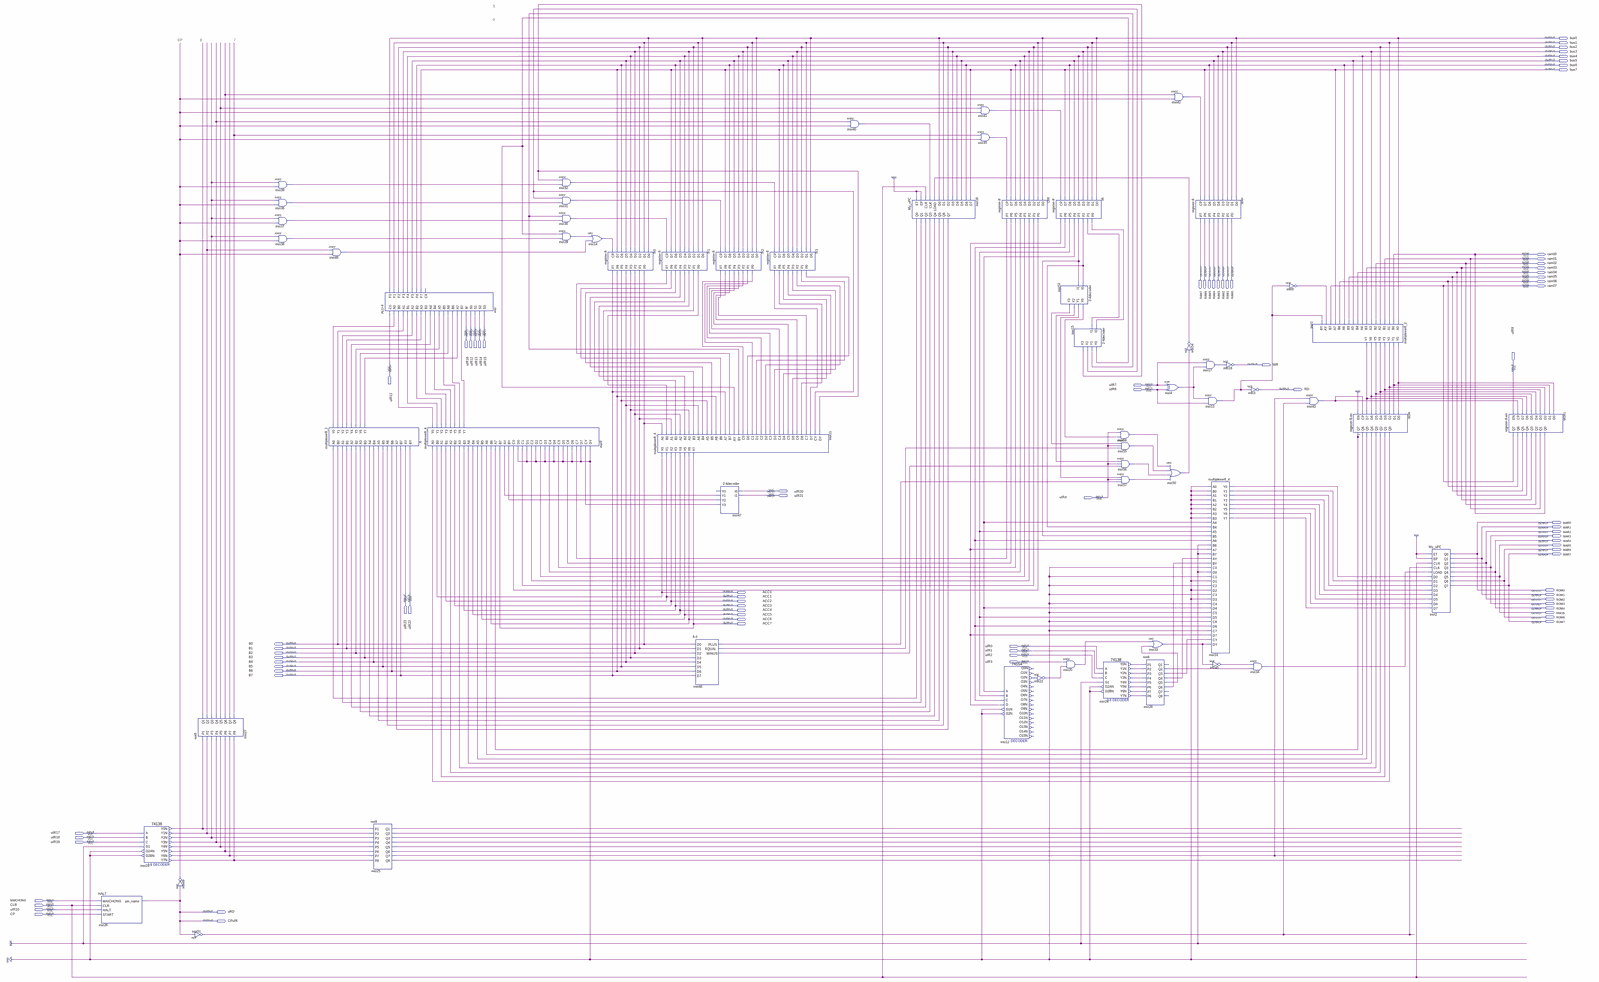
[diagram p0: schematic sheet, whole]
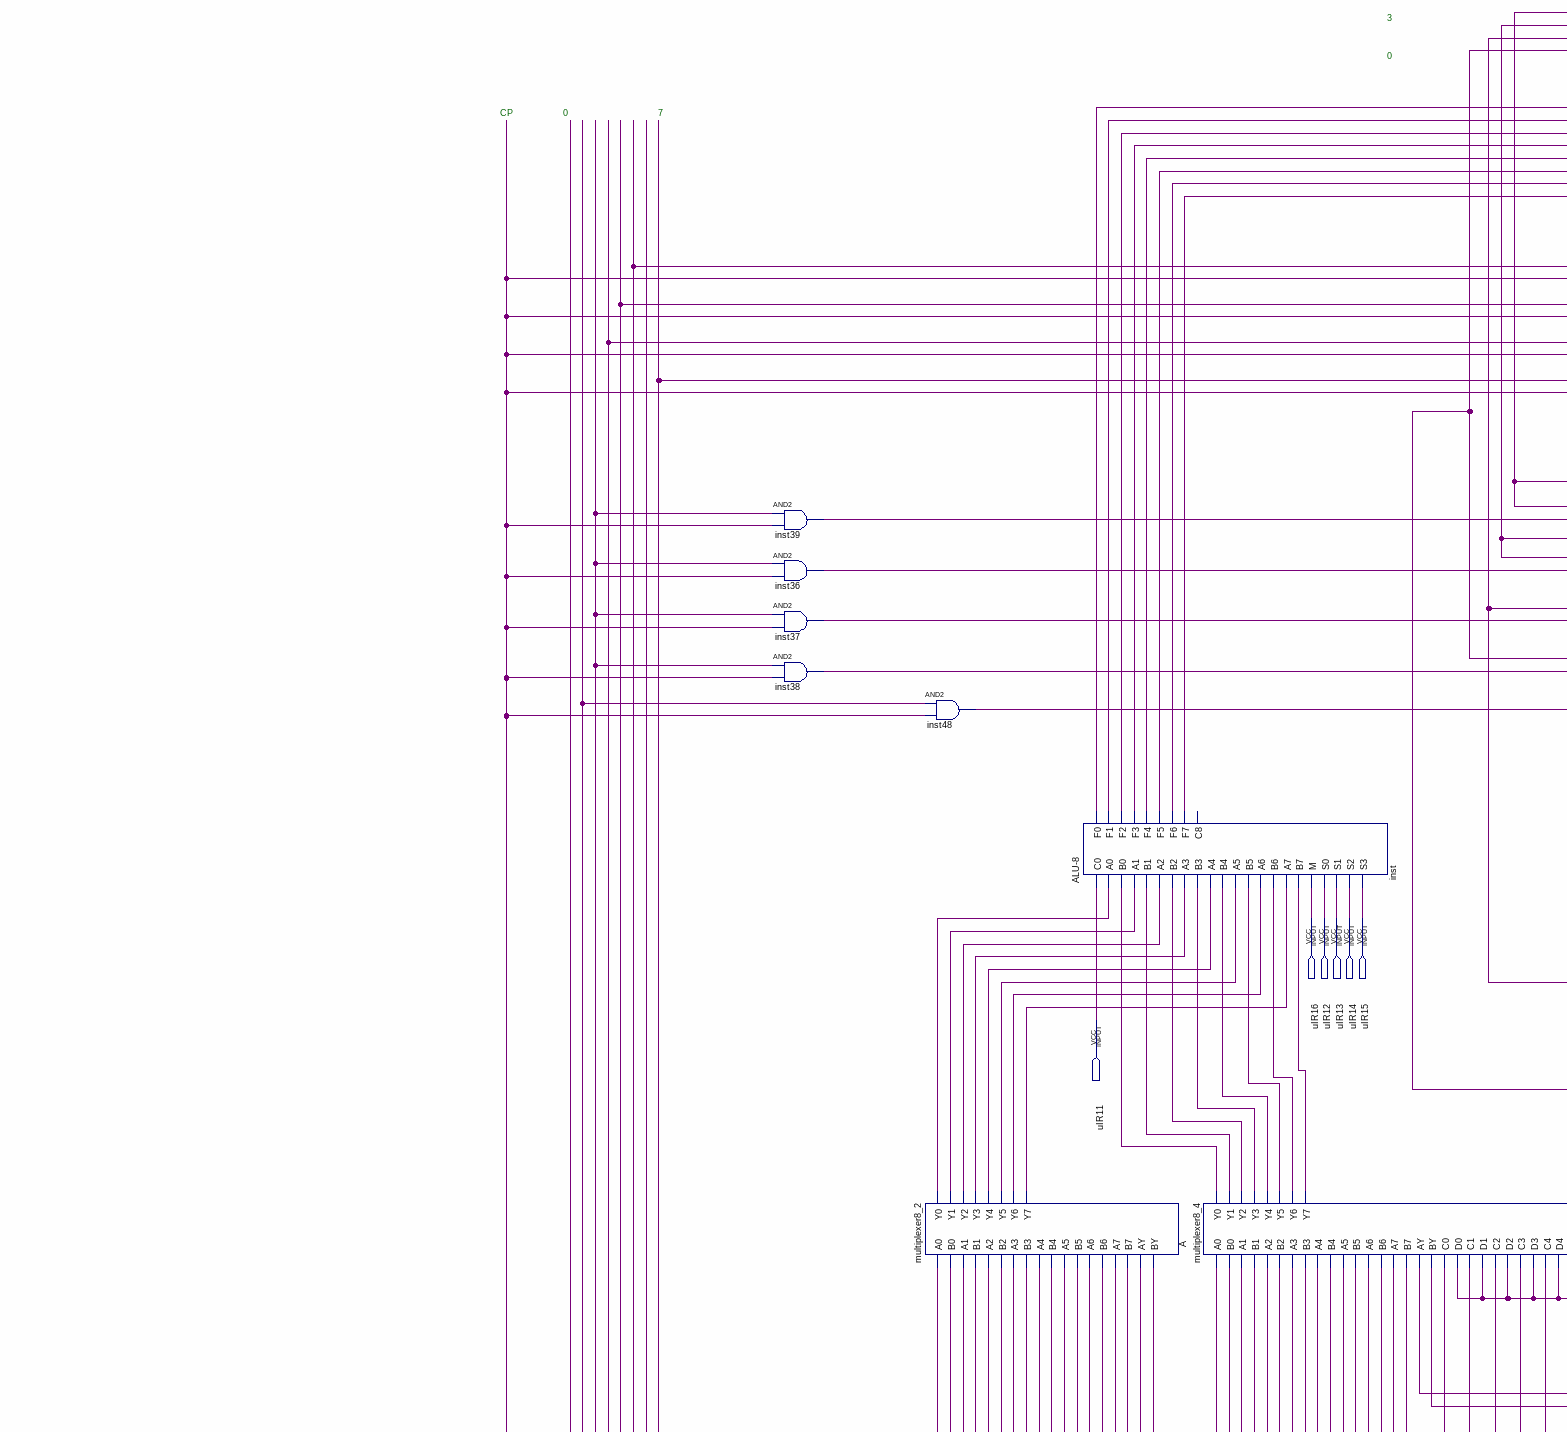
[diagram p1: schematic sheet, upper left part]
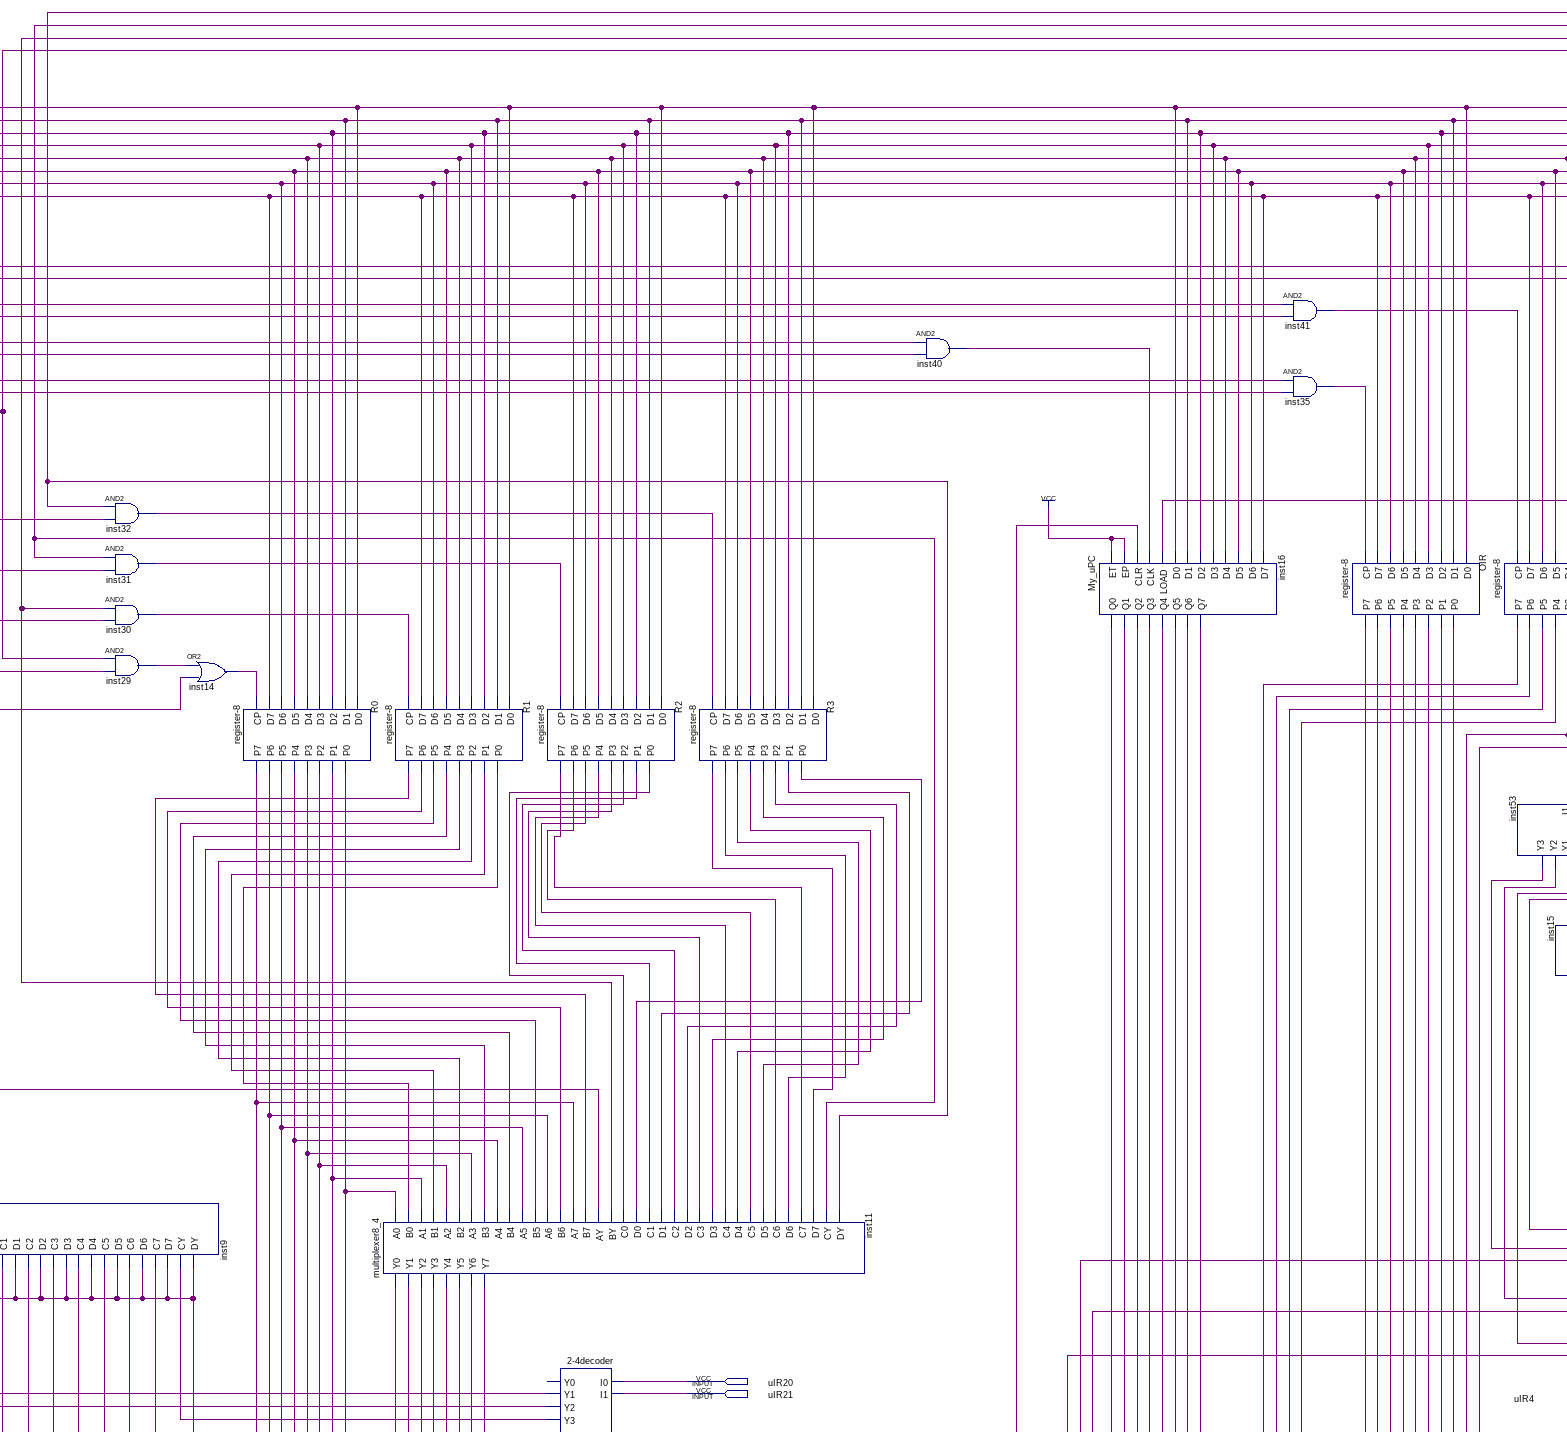
[diagram p2: schematic sheet, upper centre part]
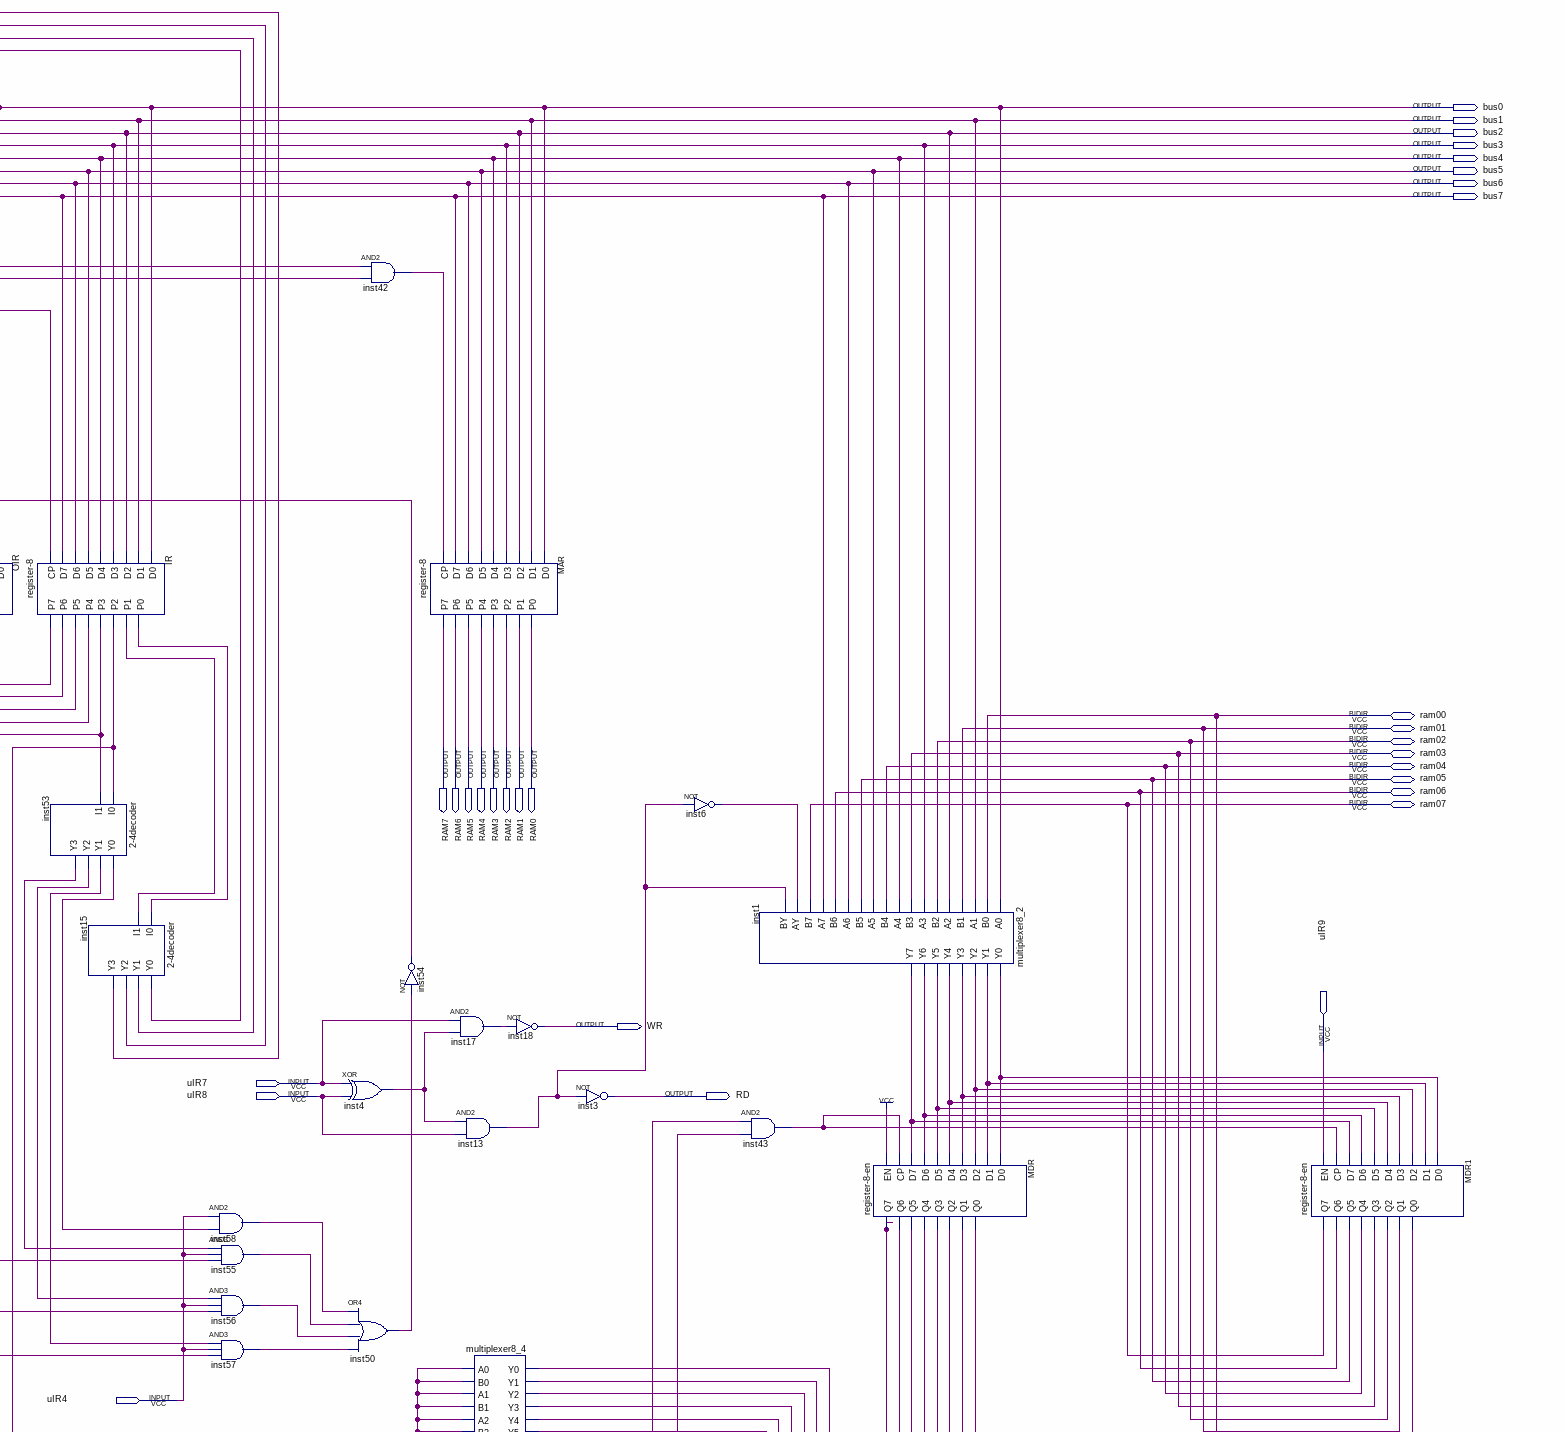
[diagram p3: schematic sheet, upper right part]
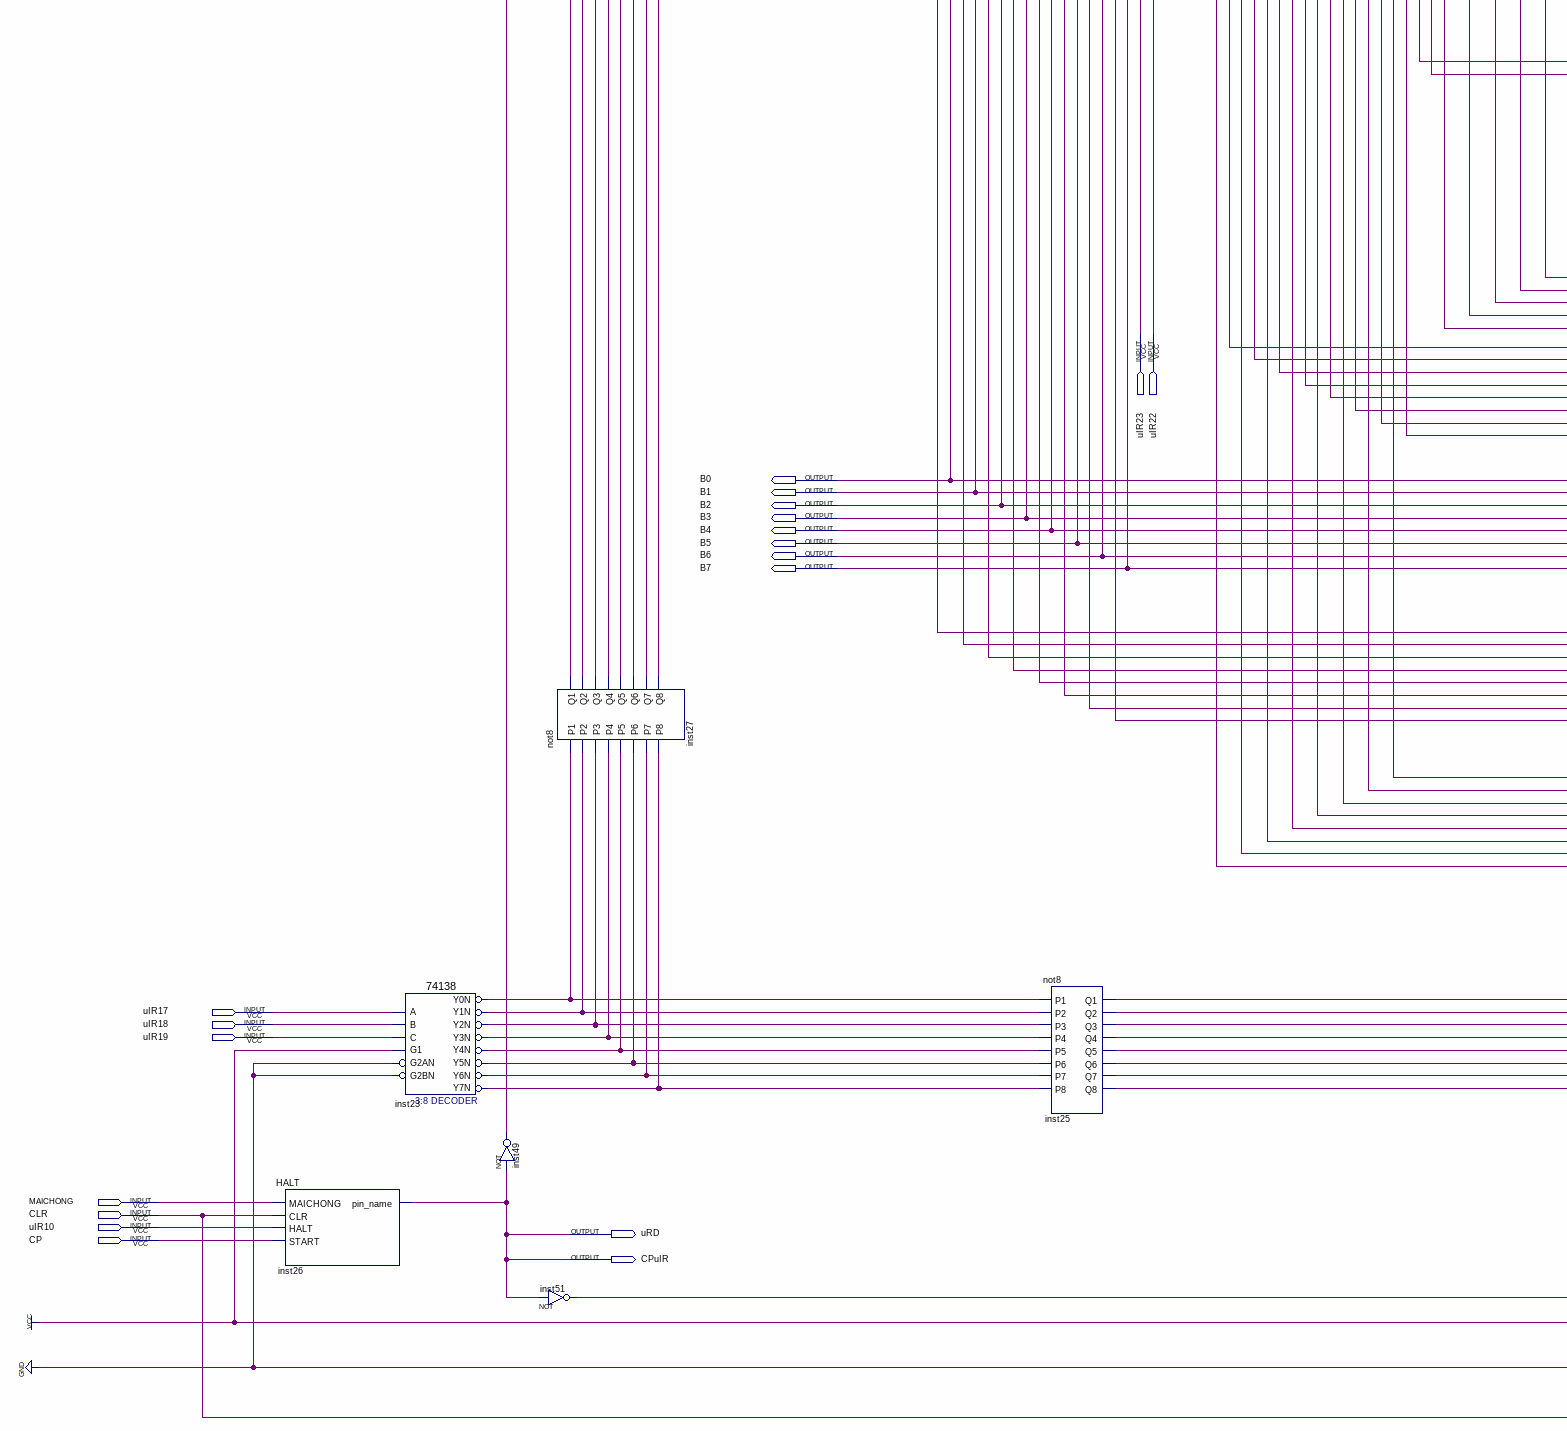
[diagram p4: schematic sheet, lower left part]
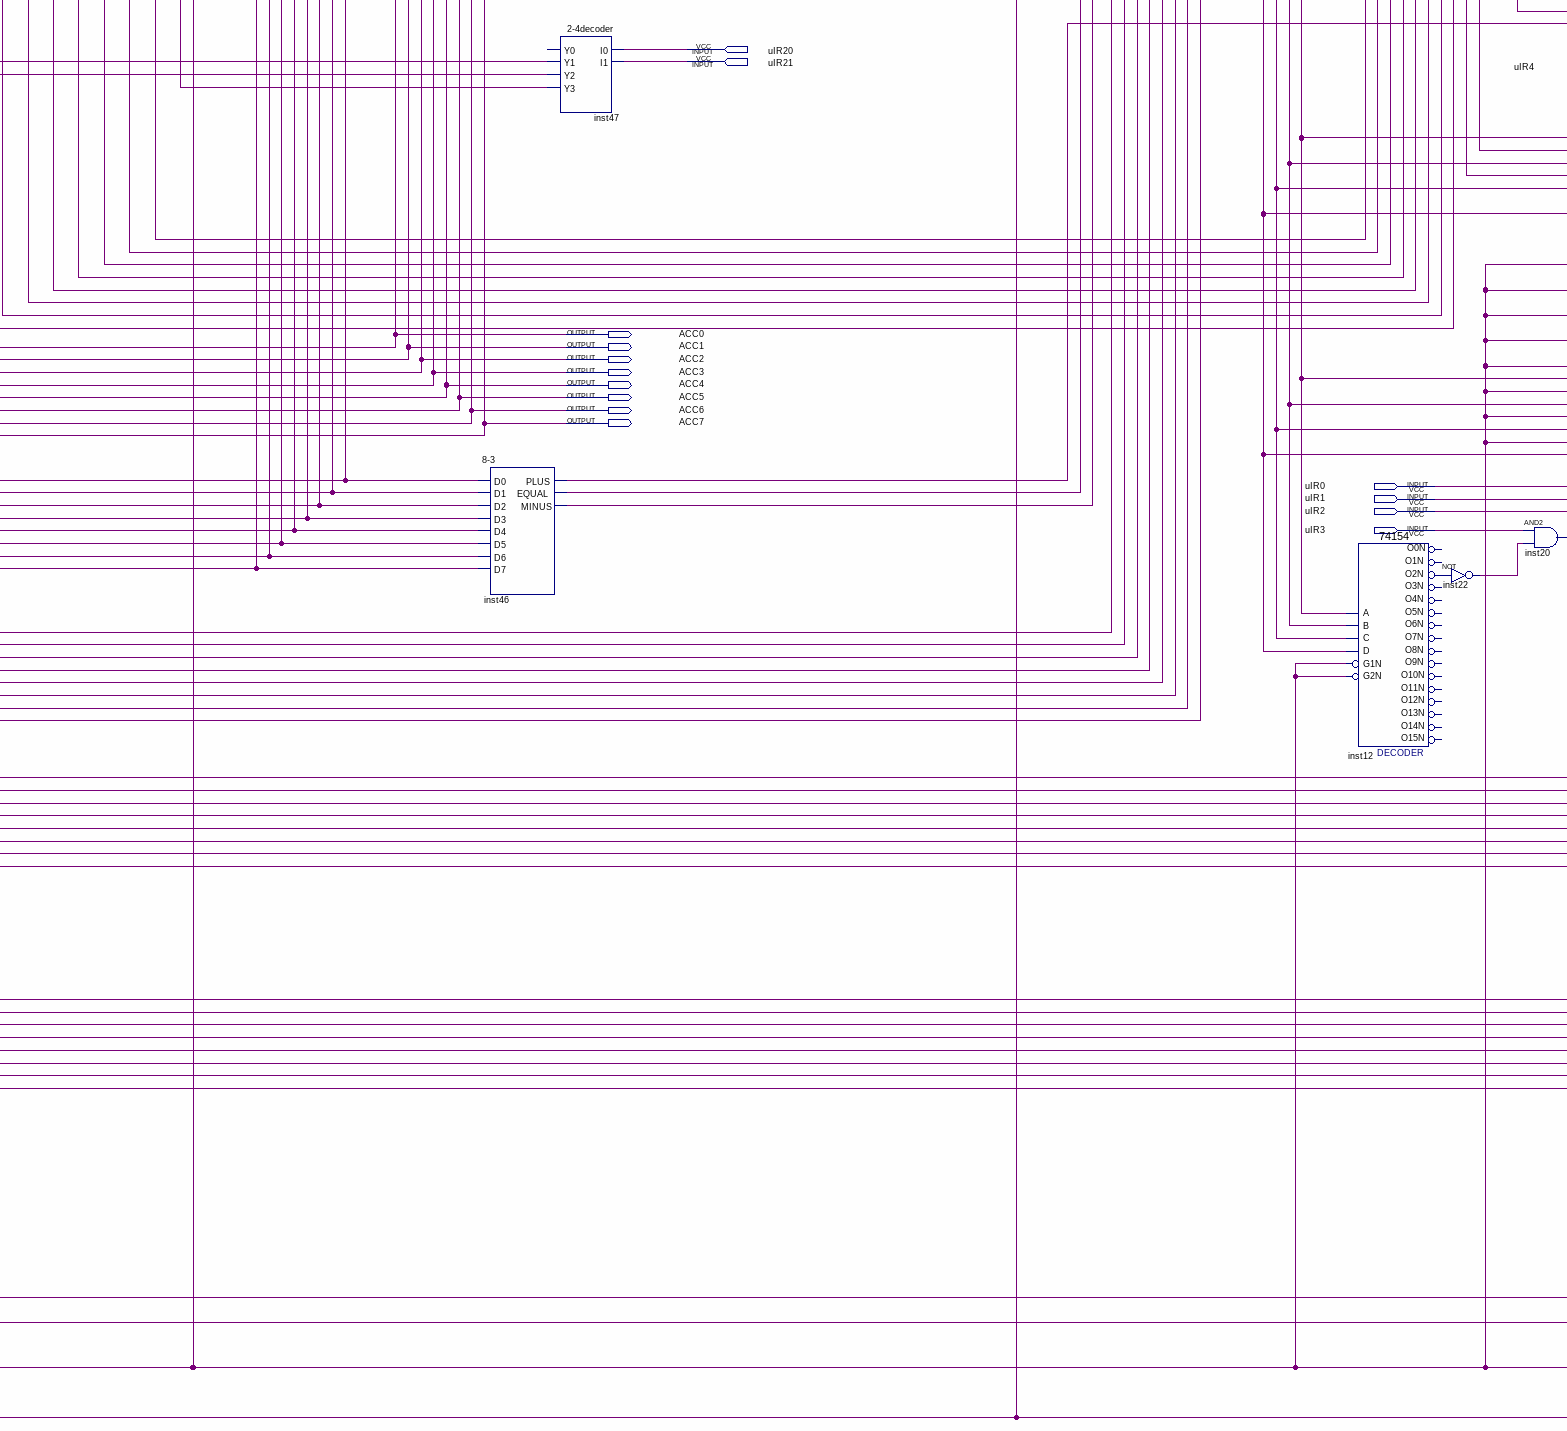
[diagram p5: schematic sheet, lower centre part]
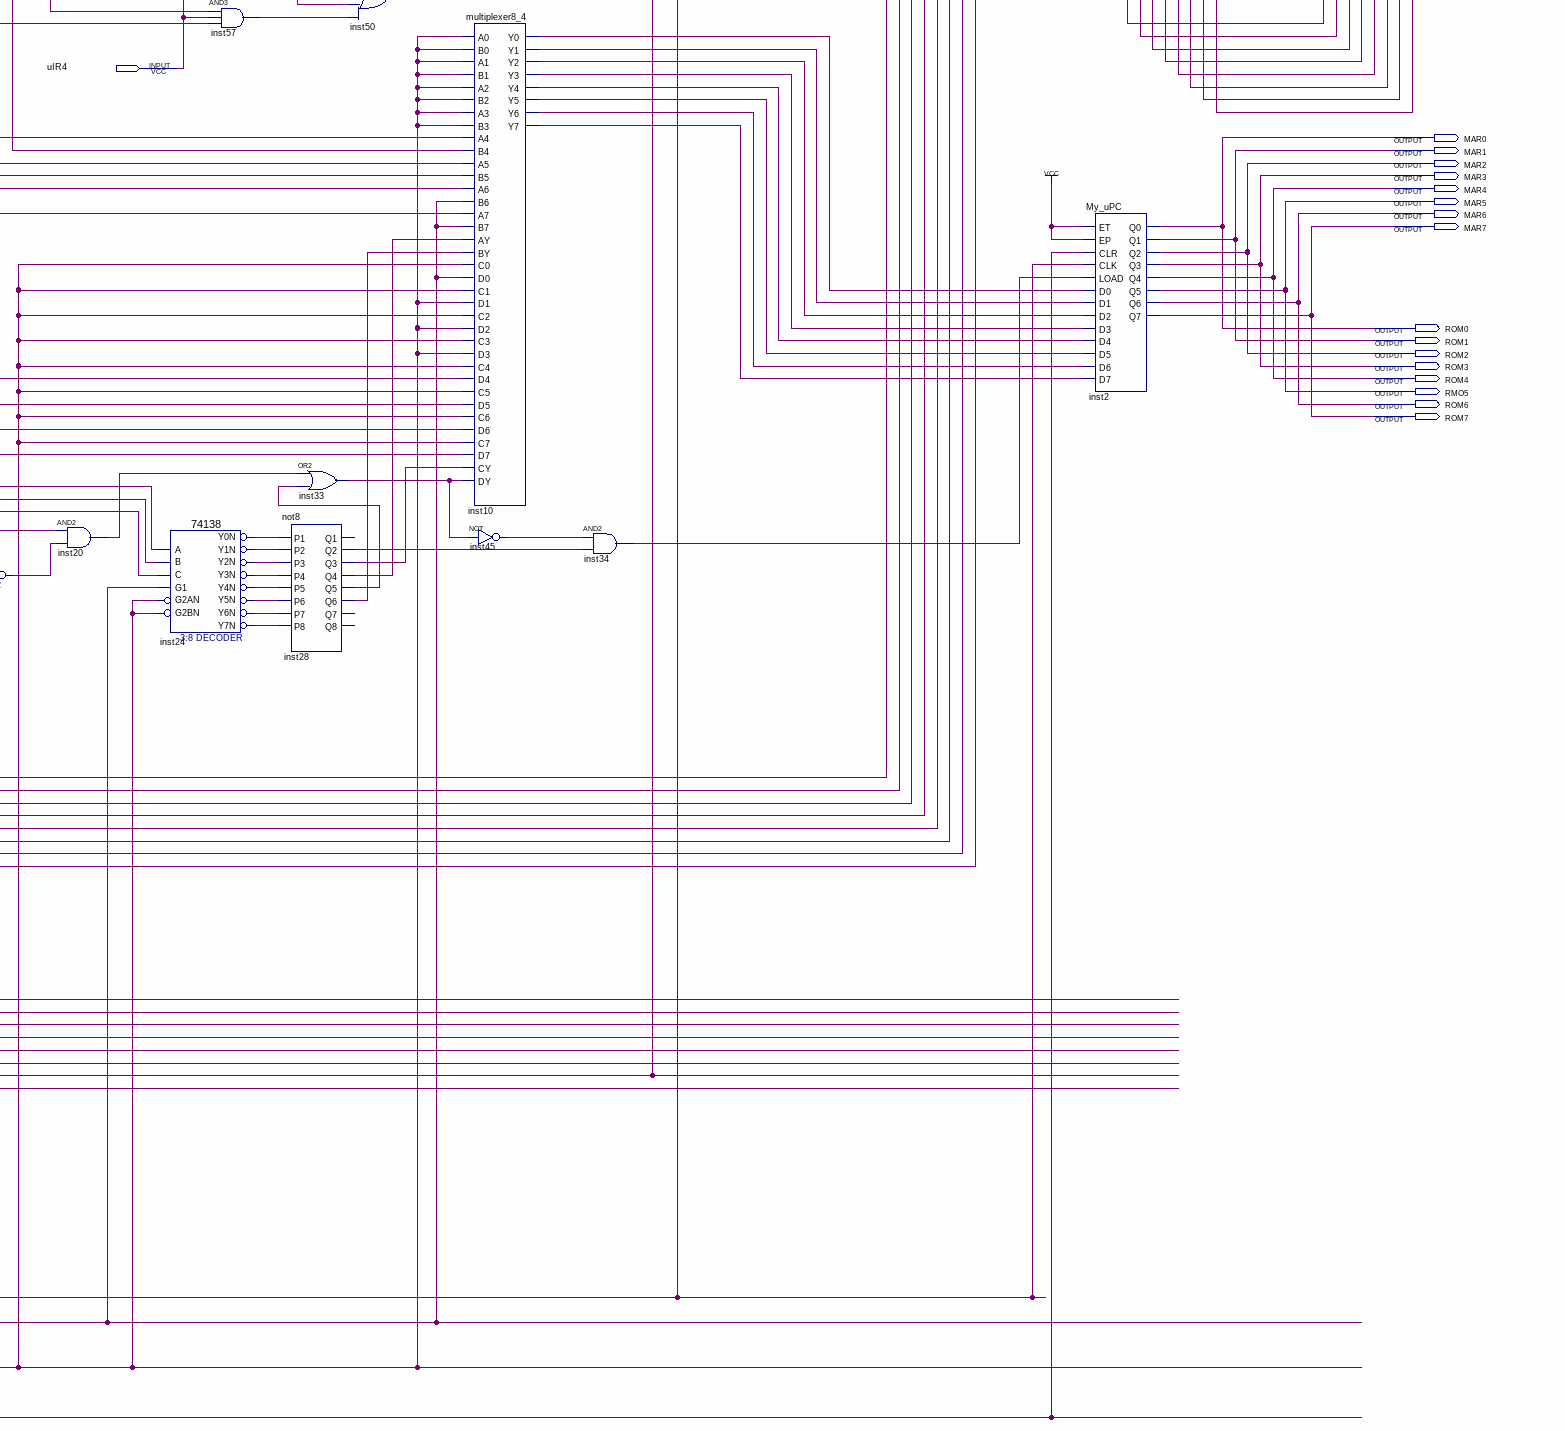
[diagram p6: schematic sheet, lower right part]
// Quartus schematic Pc.bdf as structural Verilog: 62 symbols, 85 pins
module Pc (
  input  uIR16,
  input  uIR12,
  input  uIR13,
  input  uIR14,
  input  uIR15,
  input  uIR11,
  input  uIR9,
  input  uIR7,
  input  uIR8,
  input  uIR20,
  input  uIR21,
  input  uIR4,
  input  uIR23,
  input  uIR22,
  input  uIR0,
  input  uIR1,
  input  uIR2,
  input  uIR3,
  input  uIR17,
  input  uIR18,
  input  uIR19,
  input  MAICHONG,
  input  CLR,
  input  uIR10,
  input  CP,
  inout  ram00,
  inout  ram01,
  inout  ram02,
  inout  ram03,
  inout  ram04,
  inout  ram05,
  inout  ram06,
  inout  ram07,
  output bus0,
  output bus1,
  output bus2,
  output bus3,
  output bus4,
  output bus5,
  output bus6,
  output bus7,
  output RAM7,
  output RAM6,
  output RAM5,
  output RAM4,
  output RAM3,
  output RAM2,
  output RAM1,
  output RAM0,
  output WR,
  output RD,
  output MAR0,
  output MAR1,
  output MAR2,
  output MAR3,
  output MAR4,
  output MAR5,
  output MAR6,
  output MAR7,
  output ROM0,
  output ACC0,
  output ROM1,
  output ACC1,
  output ROM2,
  output ACC2,
  output ROM3,
  output ACC3,
  output ROM4,
  output ACC4,
  output RMO5,
  output ACC5,
  output ROM6,
  output ACC6,
  output ROM7,
  output ACC7,
  output B0,
  output B1,
  output B2,
  output B3,
  output B4,
  output B5,
  output B6,
  output B7,
  output uRD,
  output CPuIR
);

  wire A_y0, A_y1, A_y2, A_y3, A_y4, A_y5, A_y6, A_y7, inst1_y0, inst1_y1, inst1_y2, inst1_y3, inst1_y4,
       inst1_y5, inst1_y6, inst1_y7, inst4_out, inst6_out, inst9_y0, inst9_y1, inst9_y2, inst9_y3, inst9_y4,
       inst9_y5, inst9_y6, inst9_y7, inst10_y0, inst10_y1, inst10_y2, inst10_y3, inst10_y4, inst10_y5,
       inst10_y6, inst10_y7, inst12_o2n, inst13_out, inst14_out, inst15_y0, inst15_y1, inst15_y2, inst15_y3,
       inst16_q0, inst16_q1, inst16_q2, inst16_q3, inst16_q4, inst16_q5, inst16_q6, inst16_q7, inst17_out,
       inst20_out, inst22_out, inst23_y0n, inst23_y1n, inst23_y2n, inst23_y3n, inst23_y4n, inst23_y5n,
       inst23_y6n, inst23_y7n, inst24_y0n, inst24_y1n, inst24_y2n, inst24_y3n, inst24_y4n, inst24_y5n,
       inst24_y6n, inst24_y7n, inst25_q1, inst25_q2, inst25_q3, inst25_q4, inst25_q5, inst25_q6, inst25_q7,
       inst25_q8, inst27_q1, inst27_q2, inst27_q3, inst27_q4, inst27_q5, inst27_q6, inst27_q7, inst27_q8,
       inst28_q2, inst28_q3, inst28_q4, inst28_q5, inst28_q6, inst29_out, inst30_out, inst31_out, inst32_out,
       inst33_out, inst34_out, inst35_out, inst36_out, inst37_out, inst38_out, inst39_out, inst40_out,
       inst41_out, inst42_out, inst43_out, inst45_out, inst46_equal, inst46_minus, inst46_plus, inst47_y1,
       inst47_y2, inst47_y3, inst48_out, inst49_out, inst50_out, inst51_out, inst53_y0, inst53_y1, inst53_y2,
       inst53_y3, inst54_out, inst55_out, inst56_out, inst57_out, inst58_out, IR_p0, IR_p1, IR_p2, IR_p3,
       IR_p4, IR_p5, IR_p6, IR_p7, MDR_q0, MDR_q1, MDR_q2, MDR_q3, MDR_q4, MDR_q5, MDR_q6, MDR_q7, OIR_p0,
       OIR_p1, OIR_p2, OIR_p3, OIR_p4, OIR_p5, OIR_p6, OIR_p7, R1_p0, R1_p1, R1_p2, R1_p3, R1_p4, R1_p5,
       R1_p6, R1_p7, R2_p0, R2_p1, R2_p2, R2_p3, R2_p4, R2_p5, R2_p6, R2_p7, R3_p0, R3_p1, R3_p2, R3_p3,
       R3_p4, R3_p5, R3_p6, R3_p7;

  HALT inst26 (.MAICHONG(MAICHONG), .CLR(CLR), .HALT(uIR10), .START(CP), .pin_name(CPuIR));
  \74138  inst23 (
    .A(uIR17), .B(uIR18), .G1(1'b1), .C(uIR19), .G2AN(1'b0), .G2BN(1'b0), .Y0N(inst23_y0n), .Y1N(inst23_y1n),
    .Y2N(inst23_y2n), .Y3N(inst23_y3n), .Y4N(inst23_y4n), .Y5N(inst23_y5n), .Y6N(inst23_y6n), .Y7N(inst23_y7n));
  not inst49 (inst49_out, CPuIR);
  not8 inst27 (
    .P1(inst23_y0n), .P2(inst23_y1n), .P3(inst23_y2n), .P4(inst23_y3n), .P5(inst23_y4n), .P6(inst23_y5n),
    .P7(inst23_y6n), .P8(inst23_y7n), .Q1(inst27_q1), .Q2(inst27_q2), .Q3(inst27_q3), .Q4(inst27_q4),
    .Q5(inst27_q5), .Q6(inst27_q6), .Q7(inst27_q7), .Q8(inst27_q8));
  not inst51 (inst51_out, CPuIR);
  and inst39 (inst39_out, inst27_q3, inst49_out);
  and inst36 (inst36_out, inst27_q3, inst49_out);
  and inst37 (inst37_out, inst27_q3, inst49_out);
  and inst38 (inst38_out, inst27_q3, inst49_out);
  multiplexer8_2 A (
    .A0(inst16_q0), .B0(B0), .A1(inst16_q1), .B1(B1), .A2(inst16_q2), .B2(B2), .A3(inst16_q3), .B3(B3),
    .A4(inst16_q4), .B4(B4), .A5(inst16_q5), .B5(B5), .A6(inst16_q6), .B6(B6), .A7(inst16_q7), .B7(B7),
    .AY(uIR23), .BY(uIR22), .Y0(A_y0), .Y1(A_y1), .Y2(A_y2), .Y3(A_y3), .Y4(A_y4), .Y5(A_y5), .Y6(A_y6),
    .Y7(A_y7));
  and inst48 (inst48_out, inst27_q2, inst49_out);
  \ALU-8  inst (
    .C0(uIR11), .A0(A_y0), .B0(inst9_y0), .A1(A_y1), .B1(inst9_y1), .A2(A_y2), .B2(inst9_y2), .A3(A_y3),
    .B3(inst9_y3), .A4(A_y4), .B4(inst9_y4), .A5(A_y5), .B5(inst9_y5), .A6(A_y6), .B6(inst9_y6), .A7(A_y7),
    .B7(inst9_y7), .M(uIR16), .S0(uIR12), .S1(uIR13), .S2(uIR14), .S3(uIR15), .F0(bus0), .F1(bus1),
    .F2(bus2), .F3(bus3), .F4(bus4), .F5(bus5), .F6(bus6), .F7(bus7));  // open: C8
  not8 inst25 (
    .P1(inst23_y0n), .P2(inst23_y1n), .P3(inst23_y2n), .P4(inst23_y3n), .P5(inst23_y4n), .P6(inst23_y5n),
    .P7(inst23_y6n), .P8(inst23_y7n), .Q1(inst25_q1), .Q2(inst25_q2), .Q3(inst25_q3), .Q4(inst25_q4),
    .Q5(inst25_q5), .Q6(inst25_q6), .Q7(inst25_q7), .Q8(inst25_q8));
  multiplexer8_4 inst9 (
    .A0(MDR_q0), .B0(ACC0), .A1(MDR_q1), .B1(ACC1), .A2(MDR_q2), .B2(ACC2), .A3(MDR_q3), .B3(ACC3),
    .A4(MDR_q4), .B4(ACC4), .A5(MDR_q5), .B5(ACC5), .A6(MDR_q6), .B6(ACC6), .A7(MDR_q7), .B7(ACC7),
    .AY(inst47_y1), .BY(inst47_y2), .C0(OIR_p0), .D0(1'b0), .C1(OIR_p1), .D1(1'b0), .C2(OIR_p2), .D2(1'b0),
    .C3(OIR_p3), .D3(1'b0), .C4(OIR_p4), .D4(1'b0), .C5(OIR_p5), .D5(1'b0), .C6(OIR_p6), .D6(1'b0),
    .C7(OIR_p7), .D7(1'b0), .CY(inst47_y3), .DY(1'b0), .Y0(inst9_y0), .Y1(inst9_y1), .Y2(inst9_y2),
    .Y3(inst9_y3), .Y4(inst9_y4), .Y5(inst9_y5), .Y6(inst9_y6), .Y7(inst9_y7));
  and inst32 (inst32_out, inst15_y3, inst39_out);
  and inst31 (inst31_out, inst15_y2, inst36_out);
  and inst30 (inst30_out, inst15_y1, inst37_out);
  and inst29 (inst29_out, inst15_y0, inst38_out);
  or inst14 (inst14_out, inst29_out, inst48_out);
  \register-8  R0 (
    .CP(inst14_out), .D7(bus7), .D6(bus6), .D5(bus5), .D4(bus4), .D3(bus3), .D2(bus2), .D1(bus1), .D0(bus0),
    .P7(B7), .P6(B6), .P5(B5), .P4(B4), .P3(B3), .P2(B2), .P1(B1), .P0(B0));
  \register-8  R1 (
    .CP(inst30_out), .D7(bus7), .D6(bus6), .D5(bus5), .D4(bus4), .D3(bus3), .D2(bus2), .D1(bus1), .D0(bus0),
    .P7(R1_p7), .P6(R1_p6), .P5(R1_p5), .P4(R1_p4), .P3(R1_p3), .P2(R1_p2), .P1(R1_p1), .P0(R1_p0));
  multiplexer8_4 inst11 (
    .A0(B0), .B0(R1_p0), .A1(B1), .B1(R1_p1), .A2(B2), .B2(R1_p2), .A3(B3), .B3(R1_p3), .A4(B4), .B4(R1_p4),
    .A5(B5), .B5(R1_p5), .A6(B6), .B6(R1_p6), .A7(B7), .B7(R1_p7), .AY(inst15_y0), .BY(inst15_y1),
    .C0(R2_p0), .D0(R3_p0), .C1(R2_p1), .D1(R3_p1), .C2(R2_p2), .D2(R3_p2), .C3(R2_p3), .D3(R3_p3),
    .C4(R2_p4), .D4(R3_p4), .C5(R2_p5), .D5(R3_p5), .C6(R2_p6), .D6(R3_p6), .C7(R2_p7), .D7(R3_p7),
    .CY(inst15_y2), .DY(inst15_y3), .Y0(ACC0), .Y1(ACC1), .Y2(ACC2), .Y3(ACC3), .Y4(ACC4), .Y5(ACC5),
    .Y6(ACC6), .Y7(ACC7));
  \8-3  inst46 (
    .D0(B0), .D1(B1), .D2(B2), .D3(B3), .D4(B4), .D5(B5), .D6(B6), .D7(B7), .PLUS(inst46_plus),
    .EQUAL(inst46_equal), .MINUS(inst46_minus));
  \register-8  R2 (
    .CP(inst31_out), .D7(bus7), .D6(bus6), .D5(bus5), .D4(bus4), .D3(bus3), .D2(bus2), .D1(bus1), .D0(bus0),
    .P7(R2_p7), .P6(R2_p6), .P5(R2_p5), .P4(R2_p4), .P3(R2_p3), .P2(R2_p2), .P1(R2_p1), .P0(R2_p0));
  \2-4decoder  inst47 (.I0(uIR20), .I1(uIR21), .Y1(inst47_y1), .Y2(inst47_y2), .Y3(inst47_y3));  // open: Y0
  \register-8  R3 (
    .CP(inst32_out), .D7(bus7), .D6(bus6), .D5(bus5), .D4(bus4), .D3(bus3), .D2(bus2), .D1(bus1), .D0(bus0),
    .P7(R3_p7), .P6(R3_p6), .P5(R3_p5), .P4(R3_p4), .P3(R3_p3), .P2(R3_p2), .P1(R3_p1), .P0(R3_p0));
  and inst40 (inst40_out, inst27_q4, inst49_out);
  My_uPC inst16 (
    .ET(1'b1), .EP(1'b1), .CLR(CLR), .CLK(inst40_out), .LOAD(inst54_out), .D0(bus0), .D1(bus1), .D2(bus2),
    .D3(bus3), .D4(bus4), .D5(bus5), .D6(bus6), .D7(bus7), .Q0(inst16_q0), .Q1(inst16_q1), .Q2(inst16_q2),
    .Q3(inst16_q3), .Q4(inst16_q4), .Q5(inst16_q5), .Q6(inst16_q6), .Q7(inst16_q7));
  and inst41 (inst41_out, inst27_q5, inst49_out);
  and inst35 (inst35_out, inst27_q8, inst49_out);
  \register-8  OIR (
    .CP(inst35_out), .D7(bus7), .D6(bus6), .D5(bus5), .D4(bus4), .D3(bus3), .D2(bus2), .D1(bus1), .D0(bus0),
    .P7(OIR_p7), .P6(OIR_p6), .P5(OIR_p5), .P4(OIR_p4), .P3(OIR_p3), .P2(OIR_p2), .P1(OIR_p1), .P0(OIR_p0));
  \74154  inst12 (
    .C(IR_p6), .D(IR_p7), .B(IR_p5), .A(IR_p4), .G1N(1'b0), .G2N(1'b0), .O2N(inst12_o2n));  // open: O0N, O12N, O15N, O10N, O11N, O1N, O13N, O14N, O4N, O3N, O7N, O6N, O5N, O9N, O8N
  not inst22 (inst22_out, inst12_o2n);
  \register-8  IR (
    .CP(inst41_out), .D7(bus7), .D6(bus6), .D5(bus5), .D4(bus4), .D3(bus3), .D2(bus2), .D1(bus1), .D0(bus0),
    .P7(IR_p7), .P6(IR_p6), .P5(IR_p5), .P4(IR_p4), .P3(IR_p3), .P2(IR_p2), .P1(IR_p1), .P0(IR_p0));
  \2-4decoder  inst53 (.I0(IR_p2), .I1(IR_p3), .Y0(inst53_y0), .Y1(inst53_y1), .Y2(inst53_y2), .Y3(inst53_y3));
  and inst20 (inst20_out, uIR3, inst22_out);
  \2-4decoder  inst15 (.I0(IR_p0), .I1(IR_p1), .Y0(inst15_y0), .Y1(inst15_y1), .Y2(inst15_y2), .Y3(inst15_y3));
  \74138  inst24 (
    .A(uIR0), .B(uIR1), .G1(1'b1), .C(uIR2), .G2AN(1'b0), .G2BN(1'b0), .Y0N(inst24_y0n), .Y1N(inst24_y1n),
    .Y2N(inst24_y2n), .Y3N(inst24_y3n), .Y4N(inst24_y4n), .Y5N(inst24_y5n), .Y6N(inst24_y6n), .Y7N(inst24_y7n));
  and inst58 (inst58_out, uIR4, inst53_y0);
  and inst55 (inst55_out, inst53_y3, uIR4, inst46_equal);
  and inst56 (inst56_out, inst53_y2, uIR4, inst46_minus);
  and inst57 (inst57_out, inst53_y1, uIR4, inst46_plus);
  or inst33 (inst33_out, inst20_out, inst28_q5);
  not8 inst28 (
    .P1(inst24_y0n), .P2(inst24_y1n), .P3(inst24_y2n), .P4(inst24_y3n), .P5(inst24_y4n), .P6(inst24_y5n),
    .P7(inst24_y6n), .P8(inst24_y7n), .Q2(inst28_q2), .Q3(inst28_q3), .Q4(inst28_q4), .Q5(inst28_q5),
    .Q6(inst28_q6));  // open: Q1, Q7, Q8
  and inst42 (inst42_out, inst27_q6, inst49_out);
  xor inst4 (inst4_out, uIR7, uIR8);
  or inst50 (inst50_out, inst58_out, inst55_out, inst56_out, inst57_out);
  \register-8  MAR (
    .CP(inst42_out), .D7(bus7), .D6(bus6), .D5(bus5), .D4(bus4), .D3(bus3), .D2(bus2), .D1(bus1), .D0(bus0),
    .P7(RAM7), .P6(RAM6), .P5(RAM5), .P4(RAM4), .P3(RAM3), .P2(RAM2), .P1(RAM1), .P0(RAM0));
  not inst54 (inst54_out, inst50_out);
  and inst17 (inst17_out, uIR7, inst4_out);
  and inst13 (inst13_out, inst4_out, uIR8);
  multiplexer8_4 inst10 (
    .A0(1'b0), .B0(1'b0), .A1(1'b0), .B1(1'b0), .A2(1'b0), .B2(1'b0), .A3(1'b0), .B3(1'b0), .A4(IR_p4),
    .B4(IR_p2), .A5(IR_p5), .B5(IR_p3), .A6(IR_p6), .B6(1'b1), .A7(IR_p7), .B7(1'b1), .AY(inst28_q4),
    .BY(inst28_q6), .C0(1'b0), .D0(1'b1), .C1(1'b0), .D1(1'b0), .C2(1'b0), .D2(1'b0), .C3(1'b0), .D3(1'b0),
    .C4(1'b0), .D4(IR_p4), .C5(1'b0), .D5(IR_p5), .C6(1'b0), .D6(IR_p6), .C7(1'b0), .D7(IR_p7),
    .CY(inst28_q3), .DY(inst33_out), .Y0(inst10_y0), .Y1(inst10_y1), .Y2(inst10_y2), .Y3(inst10_y3),
    .Y4(inst10_y4), .Y5(inst10_y5), .Y6(inst10_y6), .Y7(inst10_y7));
  not inst45 (inst45_out, inst33_out);
  not inst18 (WR, inst17_out);
  not inst3 (RD, inst13_out);
  and inst34 (inst34_out, inst45_out, inst28_q2);
  not inst6 (inst6_out, inst13_out);
  multiplexer8_2 inst1 (
    .A0(bus0), .B0(ram00), .A1(bus1), .B1(ram01), .A2(bus2), .B2(ram02), .A3(bus3), .B3(ram03), .A4(bus4),
    .B4(ram04), .A5(bus5), .B5(ram05), .A6(bus6), .B6(ram06), .A7(bus7), .B7(ram07), .AY(inst6_out),
    .BY(inst13_out), .Y0(inst1_y0), .Y1(inst1_y1), .Y2(inst1_y2), .Y3(inst1_y3), .Y4(inst1_y4),
    .Y5(inst1_y5), .Y6(inst1_y6), .Y7(inst1_y7));
  and inst43 (inst43_out, inst25_q7, inst51_out);
  \register-8-en  MDR (
    .EN(1'b1), .CP(inst43_out), .D7(inst1_y7), .D6(inst1_y6), .D5(inst1_y5), .D4(inst1_y4), .D3(inst1_y3),
    .D2(inst1_y2), .D1(inst1_y1), .D0(inst1_y0), .Q7(MDR_q7), .Q6(MDR_q6), .Q5(MDR_q5), .Q4(MDR_q4),
    .Q3(MDR_q3), .Q2(MDR_q2), .Q1(MDR_q1), .Q0(MDR_q0));
  My_uPC inst2 (
    .ET(1'b1), .EP(1'b1), .CLR(CLR), .CLK(inst51_out), .LOAD(inst34_out), .D0(inst10_y0), .D1(inst10_y1),
    .D2(inst10_y2), .D3(inst10_y3), .D4(inst10_y4), .D5(inst10_y5), .D6(inst10_y6), .D7(inst10_y7),
    .Q0(MAR0), .Q1(MAR1), .Q2(MAR2), .Q3(MAR3), .Q4(MAR4), .Q5(MAR5), .Q6(MAR6), .Q7(MAR7));
  \register-8-en  MDR1 (
    .EN(uIR9), .CP(inst43_out), .D7(inst1_y7), .D6(inst1_y6), .D5(inst1_y5), .D4(inst1_y4), .D3(inst1_y3),
    .D2(inst1_y2), .D1(inst1_y1), .D0(inst1_y0), .Q7(ram07), .Q6(ram06), .Q5(ram05), .Q4(ram04), .Q3(ram03),
    .Q2(ram02), .Q1(ram01), .Q0(ram00));

  assign RMO5 = MAR5;
  assign ROM0 = MAR0;
  assign ROM1 = MAR1;
  assign ROM2 = MAR2;
  assign ROM3 = MAR3;
  assign ROM4 = MAR4;
  assign ROM6 = MAR6;
  assign ROM7 = MAR7;
  assign uRD = CPuIR;

  // Notes on the sheet:
  //   3
  //   0
  //   CP
  //   0
  //   7
endmodule
